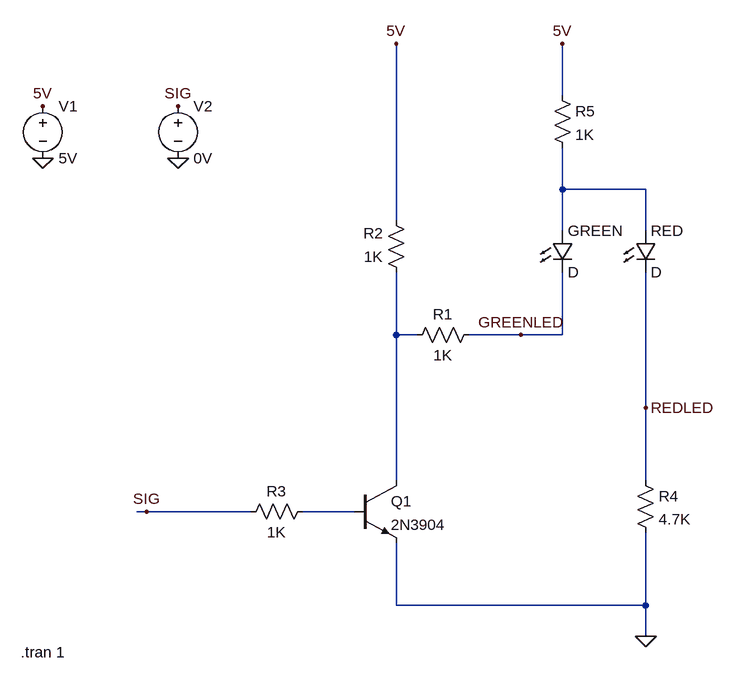
[diagram p0: schematic LEDStatus.asc]
LEDStatus.asc, the LTspice schematic file:
Version 4
SHEET 1 980 680
WIRE 608 -336 608 -416
WIRE 608 -192 608 -256
WIRE 736 -192 608 -192
WIRE 352 -144 352 -416
WIRE 608 -128 608 -192
WIRE 736 -128 736 -192
WIRE 352 32 352 -64
WIRE 384 32 352 32
WIRE 544 32 464 32
WIRE 608 32 608 -64
WIRE 608 32 544 32
WIRE 736 144 736 -64
WIRE 352 256 352 32
WIRE 736 256 736 144
WIRE -32 304 -48 304
WIRE 128 304 -32 304
WIRE 288 304 208 304
WIRE 352 448 352 352
WIRE 736 448 736 336
WIRE 736 448 352 448
WIRE 736 496 736 448
FLAG 608 -416 5V
FLAG 352 -416 5V
FLAG 736 496 0
FLAG -192 -240 0
FLAG -192 -320 5V
FLAG 16 -240 0
FLAG 16 -320 SIG
FLAG -32 304 SIG
FLAG 544 32 GREENLED
FLAG 736 144 REDLED
SYMBOL voltage -192 -336 R0
WINDOW 123 0 0 Left 0
WINDOW 39 0 0 Left 0
SYMATTR InstName V1
SYMATTR Value 5V
SYMBOL res 480 16 R90
WINDOW 0 0 56 VBottom 2
WINDOW 3 32 56 VTop 2
SYMATTR InstName R1
SYMATTR Value 1K
SYMBOL npn 288 256 R0
SYMATTR InstName Q1
SYMATTR Value 2N3904
SYMBOL res 368 -48 R180
WINDOW 0 36 76 Left 2
WINDOW 3 36 40 Left 2
SYMATTR InstName R2
SYMATTR Value 1K
SYMBOL LED 592 -128 R0
SYMATTR InstName GREEN
SYMBOL LED 720 -128 R0
SYMATTR InstName RED
SYMBOL res 224 288 R90
WINDOW 0 0 56 VBottom 2
WINDOW 3 32 56 VTop 2
SYMATTR InstName R3
SYMATTR Value 1K
SYMBOL voltage 16 -336 R0
WINDOW 123 0 0 Left 0
WINDOW 39 0 0 Left 0
SYMATTR InstName V2
SYMATTR Value 0V
SYMBOL res 720 240 R0
SYMATTR InstName R4
SYMATTR Value 4.7K
SYMBOL res 592 -352 R0
SYMATTR InstName R5
SYMATTR Value 1K
TEXT -226 520 Left 2 !.tran 1

The netlist it stands for:
* LEDStatus.asc
V1 5V 0 5V
R1 GREENLED N002 1K
Q1 N002 N003 0 0 2N3904
R2 N002 5V 1K
D§GREEN N001 GREENLED D
D§RED N001 REDLED D
R3 N003 SIG 1K
V2 SIG 0 0V
R4 REDLED 0 4.7K
R5 5V N001 1K
.model D D
.lib standard.dio
.model NPN NPN
.model PNP PNP
.lib standard.bjt
.tran 1
.backanno
.end